# Altium project UmbilicalBoardV5.PrjPcb
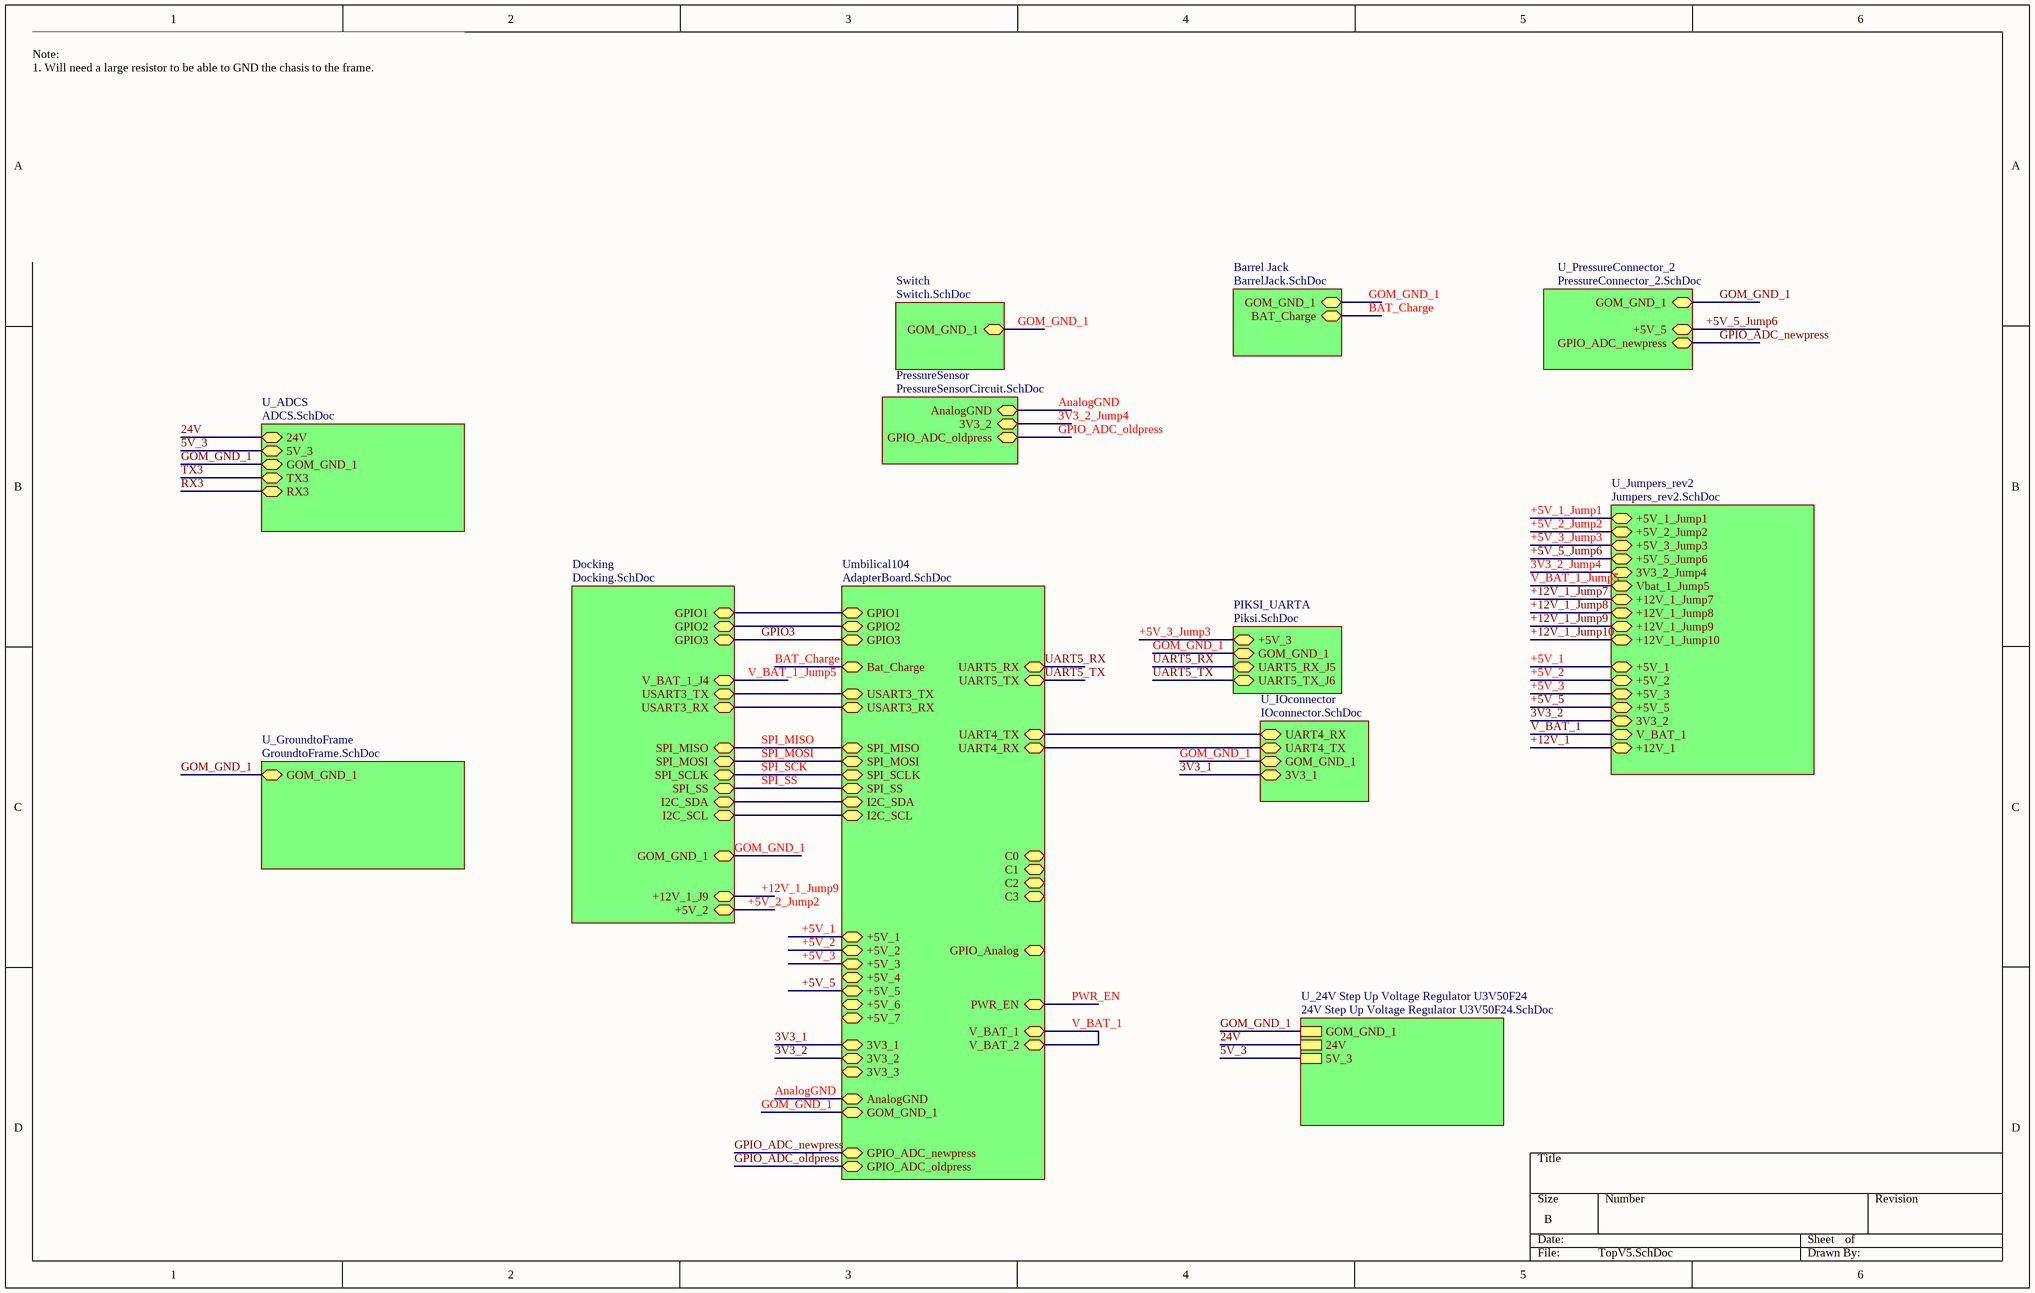
[diagram p0: TopV5.SchDoc]
13 sheets, 60 parts. Net scope: hierarchical (ports join the sheet entries above them; power ports are global).
Board files: 2016-05-17_12-43-15.PcbDoc, UmbilicalBoardV5.PcbDoc
Sheets:
  TopV5.SchDoc
    Umbilical104 = AdapterBoard.SchDoc
    Switch = Switch.SchDoc
    Docking = Docking.SchDoc
    PIKSI_UARTA = Piksi.SchDoc
    PressureSensor = PressureSensorCircuit.SchDoc
    Barrel Jack = BarrelJack.SchDoc
    U_IOconnector = IOconnector.SchDoc
    U_Jumpers_rev2 = Jumpers_rev2.SchDoc
    U_PressureConnector_2 = PressureConnector_2.SchDoc
    U_ADCS = ADCS.SchDoc
    U_24V Step Up Voltage Regulator U3V50F24 = 24V Step Up Voltage Regulator U3V50F24.SchDoc
    U_GroundtoFrame = GroundtoFrame.SchDoc

## Sheet TopV5.SchDoc
size B; Organization: Cornell University; DocumentNumber: 1 of 11; SheetNumber: 1; SheetTotal: 11; DocumentName: Top Sheet; ProjectName: OAAN

### Sub-sheets
Barrel Jack = BarrelJack.SchDoc: GOM_GND_1 (bidir), BAT_Charge (bidir)
Docking = Docking.SchDoc: V_BAT_1_J4 (bidir), USART3_TX (bidir), SPI_SS (bidir), I2C_SDA (bidir), I2C_SCL (bidir), SPI_MOSI (bidir), SPI_SCLK (bidir), GPIO3 (bidir), +5V_2 (bidir), USART3_RX (bidir), SPI_MISO (bidir), GPIO2 (bidir), +12V_1_J9 (bidir), GPIO1 (bidir), GOM_GND_1 (bidir)
PIKSI_UARTA = Piksi.SchDoc: UART5_RX_J5 (bidir), UART5_TX_J6 (bidir), GOM_GND_1 (bidir), +5V_3 (bidir)
PressureSensor = PressureSensorCircuit.SchDoc: GPIO_ADC_oldpress (bidir), 3V3_2 (bidir), AnalogGND (bidir)
Switch = Switch.SchDoc: GOM_GND_1 (bidir)
U_24V Step Up Voltage Regulator U3V50F24 = 24V Step Up Voltage Regulator U3V50F24.SchDoc: GOM_GND_1, 24V, 5V_3
U_ADCS = ADCS.SchDoc: 24V (bidir), 5V_3 (bidir), GOM_GND_1 (bidir), TX3 (bidir), RX3 (bidir)
U_GroundtoFrame = GroundtoFrame.SchDoc: GOM_GND_1 (bidir)
U_IOconnector = IOconnector.SchDoc: UART4_RX (bidir), UART4_TX (bidir), GOM_GND_1 (bidir), 3V3_1 (bidir)
U_Jumpers_rev2 = Jumpers_rev2.SchDoc: +5V_1_Jump1 (bidir), +5V_2_Jump2 (bidir), +5V_3_Jump3 (bidir), 3V3_2_Jump4 (bidir), Vbat_1_Jump5 (bidir), +5V_1 (bidir), +5V_2 (bidir), 3V3_2 (bidir), V_BAT_1 (bidir), +5V_3 (bidir), +5V_5_Jump6 (bidir), +5V_5 (bidir), +12V_1_Jump7 (bidir), +12V_1 (bidir), +12V_1_Jump9 (bidir), +12V_1_Jump8 (bidir), +12V_1_Jump10 (bidir)
U_PressureConnector_2 = PressureConnector_2.SchDoc: GOM_GND_1 (bidir), +5V_5 (bidir), GPIO_ADC_newpress (bidir)
Umbilical104 = AdapterBoard.SchDoc: C0 (bidir), 3V3_1 (bidir), USART3_TX (bidir), USART3_RX (bidir), GPIO3 (bidir), GPIO2 (bidir), GPIO1 (bidir), Bat_Charge (bidir), V_BAT_1 (bidir), I2C_SCL (bidir), SPI_MOSI (bidir), +5V_1 (bidir), I2C_SDA (bidir), SPI_MISO (bidir), SPI_SCLK (bidir), SPI_SS (bidir), UART5_RX (bidir), UART5_TX (bidir), UART4_TX (bidir), UART4_RX (bidir), C3 (bidir), C1 (bidir), C2 (bidir), +5V_3 (bidir), +5V_6 (bidir), +5V_5 (bidir), +5V_2 (bidir), 3V3_2 (bidir), +5V_4 (bidir), 3V3_3 (bidir), +5V_7 (bidir), GOM_GND_1 (bidir), AnalogGND (bidir), PWR_EN (bidir), V_BAT_2 (bidir), GPIO_ADC_newpress (bidir), GPIO_ADC_oldpress (bidir), GPIO_Analog (bidir)

### Nets
3V3_1: sheet Umbilical104/3V3_1, sheet U_IOconnector/3V3_1
3V3_2: sheet Umbilical104/3V3_2, sheet U_Jumpers_rev2/3V3_2
3V3_2_Jump4: sheet PressureSensor/3V3_2, sheet U_Jumpers_rev2/3V3_2_Jump4
5V_3: sheet U_ADCS/5V_3, sheet U_24V Step Up Voltage Regulator U3V50F24/5V_3
24V: sheet U_ADCS/24V, sheet U_24V Step Up Voltage Regulator U3V50F24/24V
+5V_1: sheet Umbilical104/+5V_1, sheet U_Jumpers_rev2/+5V_1
+5V_2: sheet Umbilical104/+5V_2, sheet U_Jumpers_rev2/+5V_2
+5V_2_Jump2: sheet Docking/+5V_2, sheet U_Jumpers_rev2/+5V_2_Jump2
+5V_3: sheet Umbilical104/+5V_3, sheet U_Jumpers_rev2/+5V_3
+5V_3_Jump3: sheet PIKSI_UARTA/+5V_3, sheet U_Jumpers_rev2/+5V_3_Jump3
+5V_5: sheet Umbilical104/+5V_5, sheet U_Jumpers_rev2/+5V_5
+5V_5_Jump6: sheet U_Jumpers_rev2/+5V_5_Jump6, sheet U_PressureConnector_2/+5V_5
+12V_1_Jump9: sheet Docking/+12V_1_J9, sheet U_Jumpers_rev2/+12V_1_Jump9
AnalogGND: sheet Umbilical104/AnalogGND, sheet PressureSensor/AnalogGND
BAT_Charge: sheet Umbilical104/Bat_Charge, sheet Barrel Jack/BAT_Charge
GOM_GND_1: sheet Umbilical104/GOM_GND_1, sheet Switch/GOM_GND_1, sheet Docking/GOM_GND_1, sheet PIKSI_UARTA/GOM_GND_1, sheet Barrel Jack/GOM_GND_1, sheet U_IOconnector/GOM_GND_1, sheet U_PressureConnector_2/GOM_GND_1, sheet U_ADCS/GOM_GND_1, sheet U_24V Step Up Voltage Regulator U3V50F24/GOM_GND_1, sheet U_GroundtoFrame/GOM_GND_1
GPIO3: sheet Umbilical104/GPIO3, sheet Docking/GPIO3
GPIO_ADC_newpress: sheet Umbilical104/GPIO_ADC_newpress, sheet U_PressureConnector_2/GPIO_ADC_newpress
GPIO_ADC_oldpress: sheet Umbilical104/GPIO_ADC_oldpress, sheet PressureSensor/GPIO_ADC_oldpress
PWR_EN: sheet Umbilical104/PWR_EN
SPI_MISO: sheet Umbilical104/SPI_MISO, sheet Docking/SPI_MISO
SPI_MOSI: sheet Umbilical104/SPI_MOSI, sheet Docking/SPI_MOSI
SPI_SCK: sheet Umbilical104/SPI_SCLK, sheet Docking/SPI_SCLK
SPI_SS: sheet Umbilical104/SPI_SS, sheet Docking/SPI_SS
UART5_RX: sheet Umbilical104/UART5_RX, sheet PIKSI_UARTA/UART5_RX_J5
UART5_TX: sheet Umbilical104/UART5_TX, sheet PIKSI_UARTA/UART5_TX_J6
V_BAT_1: sheet Umbilical104/V_BAT_1, sheet Umbilical104/V_BAT_2, sheet U_Jumpers_rev2/V_BAT_1
V_BAT_1_Jump5: sheet Docking/V_BAT_1_J4, sheet U_Jumpers_rev2/Vbat_1_Jump5
NetDocking_0: sheet Umbilical104/GPIO1, sheet Docking/GPIO1
NetDocking_1: sheet Umbilical104/GPIO2, sheet Docking/GPIO2
NetDocking_15: sheet Umbilical104/USART3_TX, sheet Docking/USART3_TX
NetDocking_16: sheet Umbilical104/USART3_RX, sheet Docking/USART3_RX
NetDocking_22: sheet Umbilical104/I2C_SDA, sheet Docking/I2C_SDA
NetDocking_23: sheet Umbilical104/I2C_SCL, sheet Docking/I2C_SCL
NetIOconn_rev2_1: sheet Umbilical104/UART4_TX, sheet U_IOconnector/UART4_RX
NetIOconn_rev2_2: sheet Umbilical104/UART4_RX, sheet U_IOconnector/UART4_TX

### Notes on the sheet
- Note:
  1. Will need a large resistor to be able to GND the chasis to the frame.

## Sheet AdapterBoard.SchDoc
size C
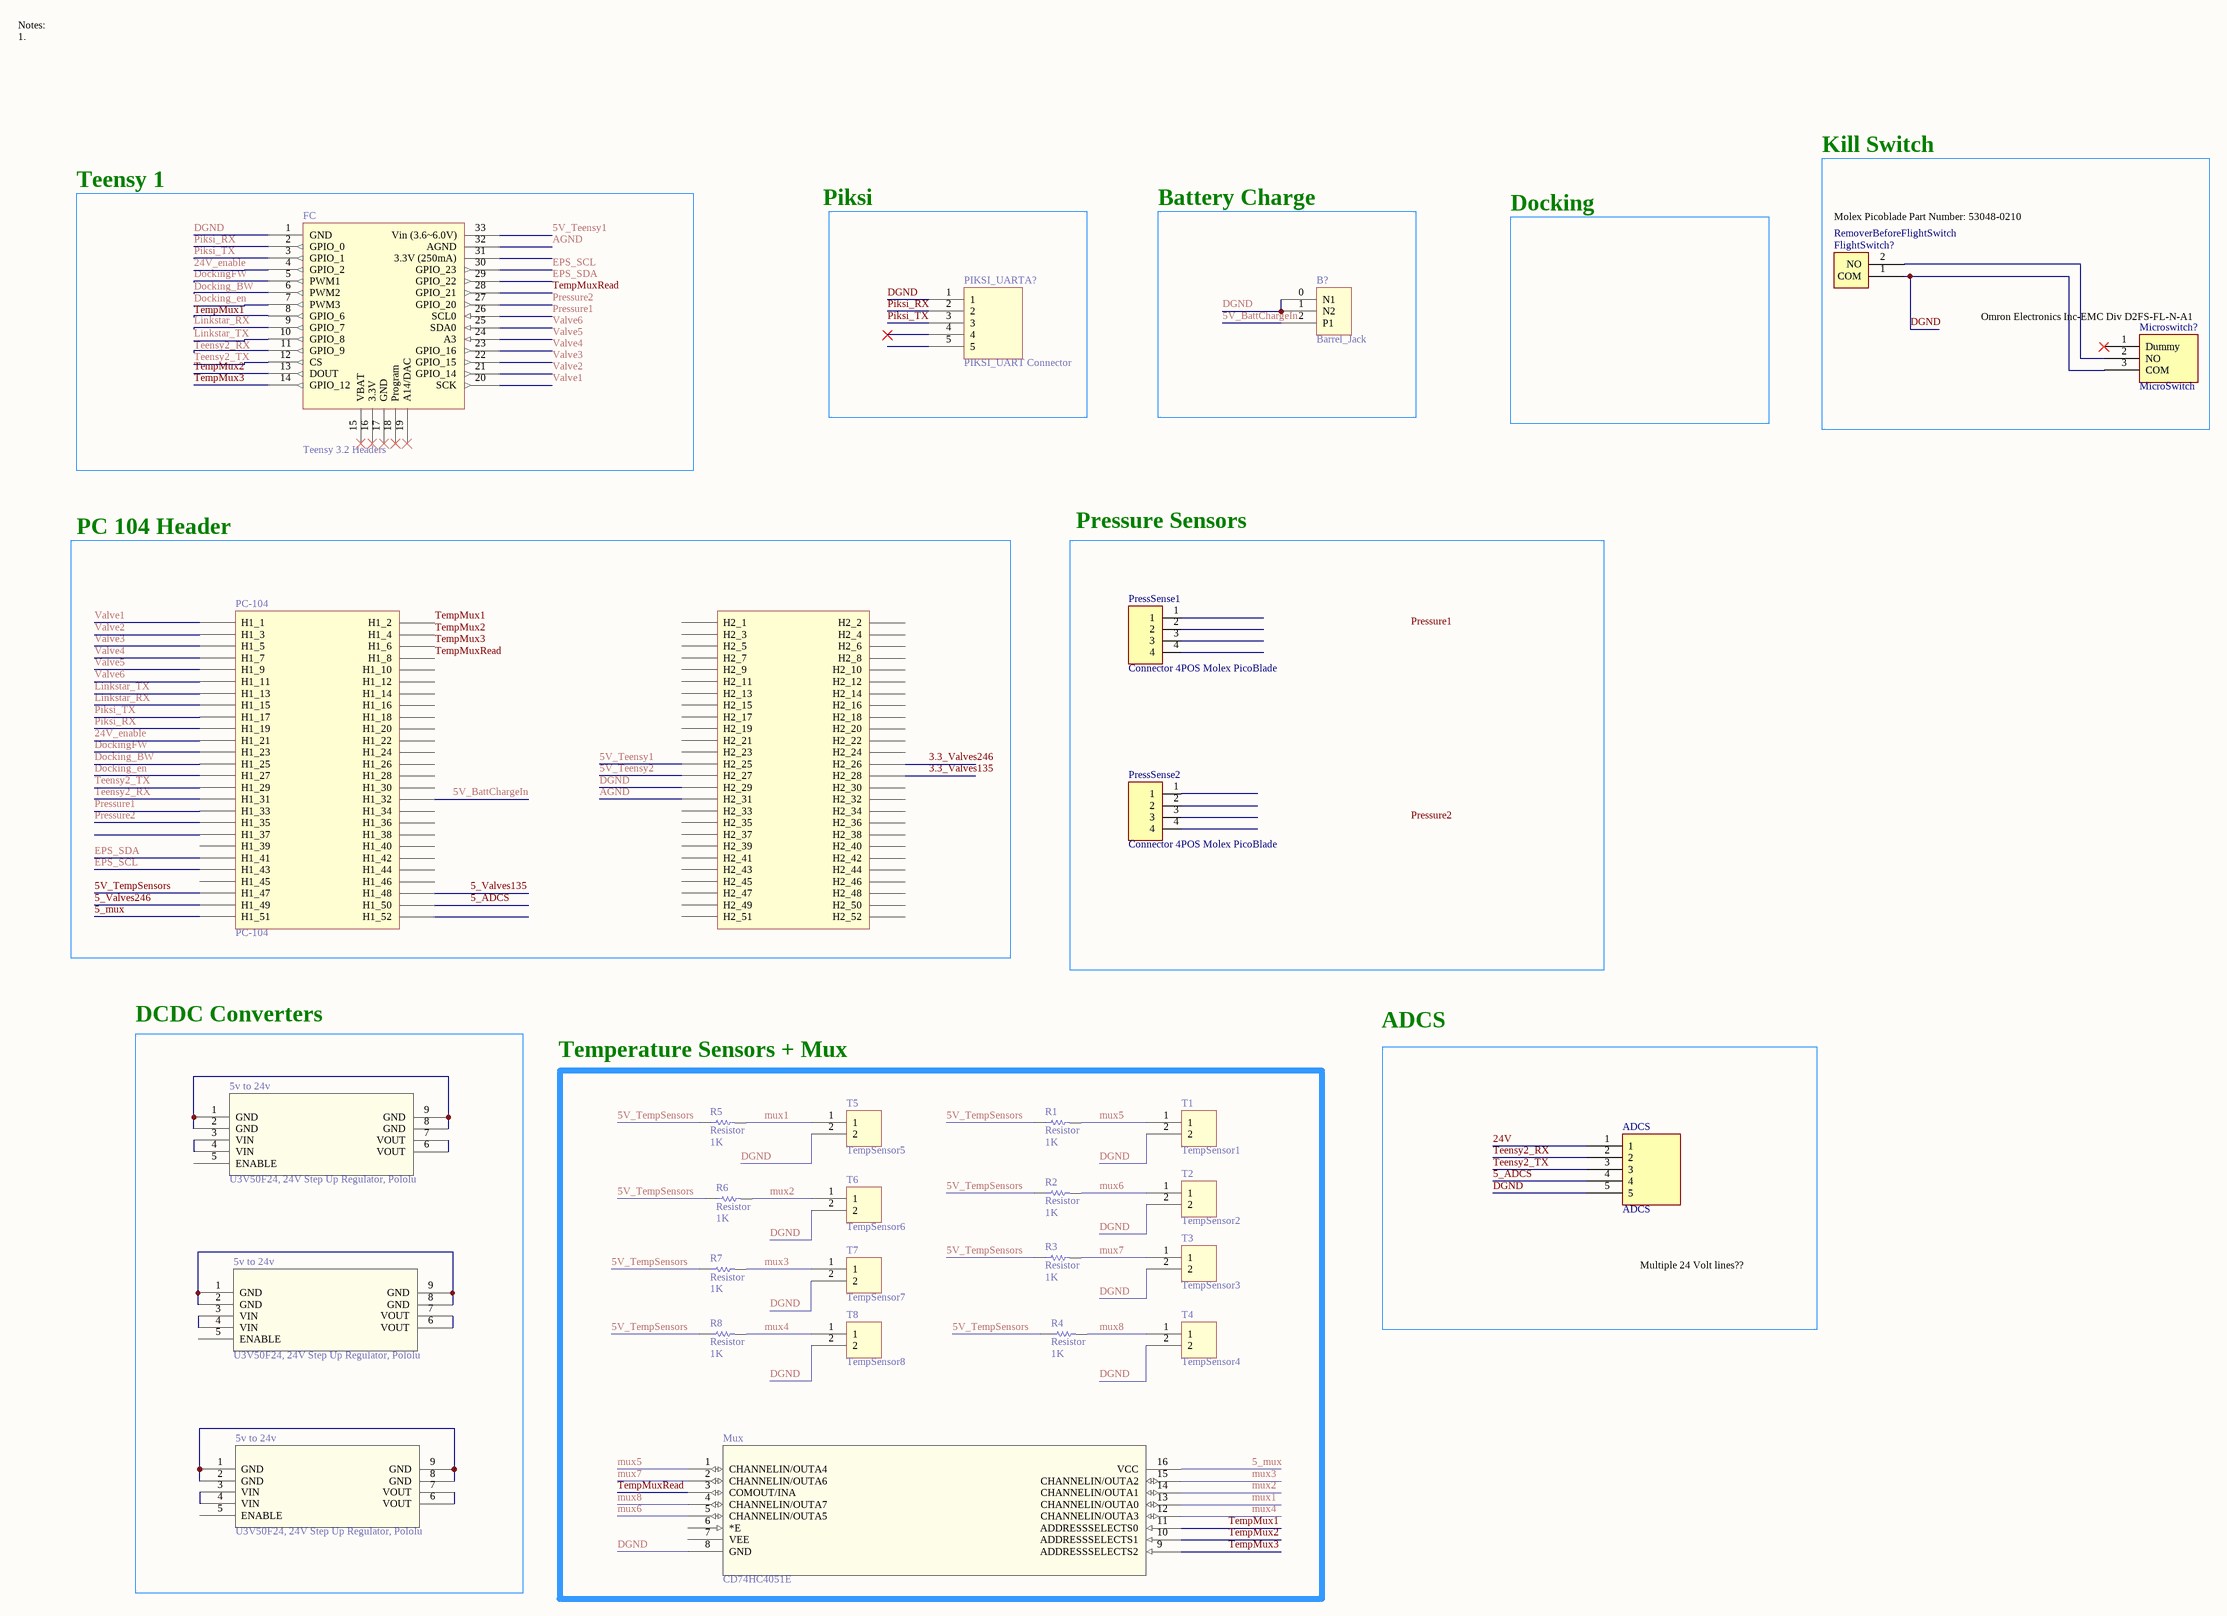
[diagram p1: AdapterBoard.SchDoc]

### Parts
(Parts that share a designator on the sheet are numbered #1, #2 ... from top to bottom, then left to right.)
5v_to_24v#1  U3V50F24, 24V Step Up Regulator, Pololu  [U3V50F24]
5v_to_24v#2  U3V50F24, 24V Step Up Regulator, Pololu  [U3V50F24]
5v_to_24v#3  U3V50F24, 24V Step Up Regulator, Pololu  [U3V50F24]
ADCS  ADCS  [Molex Picoblade 5 Pin]
B?  Barrel_Jack  [Barrel_Jack]
FC  Teensy 3.2 Headers  [Teensy 3.2 SMD Headers]
FlightSwitch?  RemoverBeforeFlightSwitch  [RemoverBeforeFlight Switch]
Microswitch?  MicroSwitch  [MicroSwitch_3pin]
Mux  CD74HC4051E  [N16]
PC-104  PC-104  [PC-104FOOTPRINT]
PIKSI_UARTA?  PIKSI_UART Connector  [Molex Picoblade 5 Pin]
PressSense1  Connector 4POS Molex PicoBlade  [532610471]
PressSense2  Connector 4POS Molex PicoBlade  [532610471]
R1  Resistor  value 1K  [AXIAL-0.3]
R2  Resistor  value 1K  [AXIAL-0.3]
R3  Resistor  value 1K  [AXIAL-0.3]
R4  Resistor  value 1K  [AXIAL-0.3]
R5  Resistor  value 1K  [AXIAL-0.3]
R6  Resistor  value 1K  [AXIAL-0.3]
R7  Resistor  value 1K  [AXIAL-0.3]
R8  Resistor  value 1K  [AXIAL-0.3]
T1  TempSensor1  [RemoverBeforeFlight Switch]
T2  TempSensor2  [RemoverBeforeFlight Switch]
T3  TempSensor3  [RemoverBeforeFlight Switch]
T4  TempSensor4  [RemoverBeforeFlight Switch]
T5  TempSensor5  [RemoverBeforeFlight Switch]
T6  TempSensor6  [RemoverBeforeFlight Switch]
T7  TempSensor7  [RemoverBeforeFlight Switch]
T8  TempSensor8  [RemoverBeforeFlight Switch]

### Blocks framed on the sheet
Kill Switch: FlightSwitch? Microswitch?
Teensy 1: FC
Battery Charge: B?
PC 104 Header: PC-104
Pressure Sensors: PressSense1 PressSense2
DCDC Converters: 5v_to_24v#1-5v_to_24v#3
ADCS: ADCS
Temperature Sensors + Mux: Mux R1-R8 T1-T8

### Nets
3.3_Valves135: PC-104.H2_28
3.3_Valves246: PC-104.H2_26
5_ADCS: ADCS.4 PC-104.H1_50
5_mux: Mux.16(VCC) PC-104.H1_51
5_Valves135: PC-104.H1_48
5_Valves246: PC-104.H1_49
5V_BattChargeIn: B?.2(P1) PC-104.H1_32
5V_Teensy1: FC.33(Vin_(3.6~6.0V)) PC-104.H2_25
5V_Teensy2: PC-104.H2_27
5V_TempSensors: PC-104.H1_47 R1.1 R2.1 R3.1 R4.1 R5.1 R6.1 R7.1 R8.1
24V: ADCS.1
24V_enable: FC.4(GPIO_2) PC-104.H1_21
AGND: FC.32(AGND) PC-104.H2_31
DGND: ADCS.5 B?.0(N1) B?.1(N2) FC.1(GND) FlightSwitch?.1(COM) Microswitch?.3(COM) Mux.8(GND) PC-104.H2_29 PIKSI_UARTA?.1 T1.2 T2.2 T3.2 T4.2 T5.2 T6.2 T7.2 T8.2
Docking_BW: FC.6(PWM2) PC-104.H1_25
Docking_en: FC.7(PWM3) PC-104.H1_27
DockingFW: FC.5(PWM1) PC-104.H1_23
EPS_SCL: FC.30(GPIO_23) PC-104.H1_43
EPS_SDA: FC.29(GPIO_22) PC-104.H1_41
Linkstar_RX: FC.9(GPIO_7) PC-104.H1_15
Linkstar_TX: FC.10(GPIO_8) PC-104.H1_13
mux1: Mux.13(CHANNELIN/OUTA0) R5.2 T5.1
mux2: Mux.14(CHANNELIN/OUTA1) R6.2 T6.1
mux3: Mux.15(CHANNELIN/OUTA2) R7.2 T7.1
mux4: Mux.12(CHANNELIN/OUTA3) R8.2 T8.1
mux5: Mux.1(CHANNELIN/OUTA4) R1.2 T1.1
mux6: Mux.5(CHANNELIN/OUTA5) R2.2 T2.1
mux7: Mux.2(CHANNELIN/OUTA6) R3.2 T3.1
mux8: Mux.4(CHANNELIN/OUTA7) R4.2 T4.1
Piksi_RX: FC.2(GPIO_0) PC-104.H1_19 PIKSI_UARTA?.2
Piksi_TX: FC.3(GPIO_1) PC-104.H1_17 PIKSI_UARTA?.3
Pressure1: FC.26(SCL0) PC-104.H1_33
Pressure2: FC.27(GPIO_20) PC-104.H1_35
Teensy2_RX: ADCS.2 FC.11(GPIO_9) PC-104.H1_31
Teensy2_TX: ADCS.3 FC.12(CS) PC-104.H1_29
TempMux1: FC.8(GPIO_6) Mux.11(ADDRESSSELECTS0) PC-104.H1_2
TempMux2: FC.13(DOUT) Mux.10(ADDRESSSELECTS1) PC-104.H1_4
TempMux3: FC.14(GPIO_12) Mux.9(ADDRESSSELECTS2) PC-104.H1_6
TempMuxRead: FC.28(GPIO_21) Mux.3(COMOUT/INA) PC-104.H1_8
Valve1: FC.20(SCK) PC-104.H1_1
Valve2: FC.21(GPIO_14) PC-104.H1_3
Valve3: FC.22(GPIO_15) PC-104.H1_5
Valve4: FC.23(GPIO_16) PC-104.H1_7
Valve5: FC.24(A3) PC-104.H1_9
Valve6: FC.25(SDA0) PC-104.H1_11
Net5v_to_24v#1_1: 5v_to_24v#1.1(GND) 5v_to_24v#1.2(GND) 5v_to_24v#1.8(GND) 5v_to_24v#1.9(GND)
Net5v_to_24v#1_3: 5v_to_24v#1.3(VIN) 5v_to_24v#1.4(VIN)
Net5v_to_24v#1_6: 5v_to_24v#1.6(VOUT) 5v_to_24v#1.7(VOUT)
Net5v_to_24v#2_1: 5v_to_24v#2.1(GND) 5v_to_24v#2.2(GND) 5v_to_24v#2.8(GND) 5v_to_24v#2.9(GND)
Net5v_to_24v#2_3: 5v_to_24v#2.3(VIN) 5v_to_24v#2.4(VIN)
Net5v_to_24v#3_1: 5v_to_24v#3.1(GND) 5v_to_24v#3.2(GND) 5v_to_24v#3.8(GND) 5v_to_24v#3.9(GND)
Net5v_to_24v#3_3: 5v_to_24v#3.3(VIN) 5v_to_24v#3.4(VIN)
Net5v_to_24v#3_6: 5v_to_24v#3.6(VOUT) 5v_to_24v#3.7(VOUT)
NetFlightSwitch?_2: FlightSwitch?.2(NO) Microswitch?.2(NO)

Not connected (* = marked no-connect by the designer): 5v_to_24v#1 5(ENABLE); 5v_to_24v#2 5(ENABLE) 6(VOUT) 7(VOUT); 5v_to_24v#3 5(ENABLE); FC 15(VBAT)* 16(3.3V)* 17(GND)* 18(Program)* 19(A14/DAC)* 31(3.3V_(250mA)); Microswitch? 1(Dummy)*; Mux 6(*E) 7(VEE); PC-104 H1_10 H1_12 H1_14 H1_16 H1_18 H1_20 H1_22 H1_24 H1_26 H1_28 H1_30 H1_34 H1_36 H1_37 H1_38 H1_39 H1_40 H1_42 H1_44 H1_45 H1_46 H1_52 H2_1 H2_2 H2_3 H2_4 H2_5 H2_6 H2_7 H2_8 H2_9 H2_10 H2_11 H2_12 H2_13 H2_14 H2_15 H2_16 H2_17 H2_18 H2_19 H2_20 H2_21 H2_22 H2_23 H2_24 H2_30 H2_32 H2_33 H2_34 H2_35 H2_36 H2_37 H2_38 H2_39 H2_40 H2_41 H2_42 H2_43 H2_44 H2_45 H2_46 H2_47 H2_48 H2_49 H2_50 H2_51 H2_52; PIKSI_UARTA? 4* 5; PressSense1 1 2 3 4; PressSense2 1 2 3 4

### Notes on the sheet
- Notes:
  1.
- Piksi
- Docking
- (near FlightSwitch?) Molex Picoblade Part Number: 53048-0210
- (near Microswitch?) Omron Electronics Inc-EMC Div D2FS-FL-N-A1
- Multiple 24 Volt lines??
- Labels drawn without touching a wire or pin: Pressure1, Pressure2

### Library data of the parts
5v_to_24v#1-5v_to_24v#3 = U3V50F24, 24V Step Up Regulator, Pololu: 4V Step Up Regulator
ADCS PIKSI_UARTA? = PIKSI_UART Connector: Molex Picoblade 53261-0571
FlightSwitch? T1-T8 = RemoverBeforeFlightSwitch: 53048-0210 Molex Picoblade
Microswitch? = MicroSwitch: Omron Electronics Inc-EMC Div D2FS-FL-N-A1
Mux = CD74HC4051E: Imported; Vendor: Texas Instruments; Section: Unknown; C: Copyright (C) 2015 Accelerated Designs. All rights reserved; Manufacturer_Part_Number: CD74HC4051E; Family: Unknown; Manufacturer_Name: Texas Instruments; Copyright: Copyright (C) 2015 Accelerated Designs. All rights reserved; RS_Part_Number: 526694; Value: Value; Type: Type; RefDes: RefDes
PC-104 = PC-104: ESQ-126-14-G-D (2 total needed)
PressSense1 PressSense2 = 532610471
R1-R8 = Res1: Published: 8-Jun-2000; LatestRevisionDate: 17-Jul-2002; LatestRevisionNote: Re-released for DXP Platform.; PackageReference: AXIAL-0.3; Publisher: Altium Limited; PackageDescription: Axial Device, Thru-Hole; 2 Leads; 0.3 in Pin Spacing

## Sheet Switch.SchDoc
size B
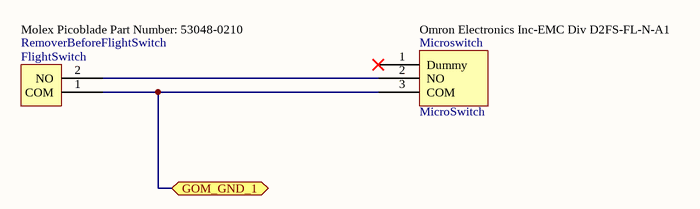
[diagram p2: Switch.SchDoc]

### Parts
FlightSwitch  RemoverBeforeFlightSwitch  [RemoverBeforeFlight Switch]
Microswitch  MicroSwitch  [MicroSwitch_3pin]

### Ports
GOM_GND_1 (bidir)

### Nets
GOM_GND_1: FlightSwitch.1(COM) Microswitch.3(COM) ; port GOM_GND_1
NetFlightSwitch_2: FlightSwitch.2(NO) Microswitch.2(NO)

Not connected (* = marked no-connect by the designer): Microswitch 1(Dummy)*

### Notes on the sheet
- (near FlightSwitch) Molex Picoblade Part Number: 53048-0210
- (near Microswitch) Omron Electronics Inc-EMC Div D2FS-FL-N-A1

### Library data of the parts
FlightSwitch = RemoverBeforeFlightSwitch: 53048-0210 Molex Picoblade
Microswitch = MicroSwitch: as Microswitch? on sheet AdapterBoard

## Sheet Docking.SchDoc
size B
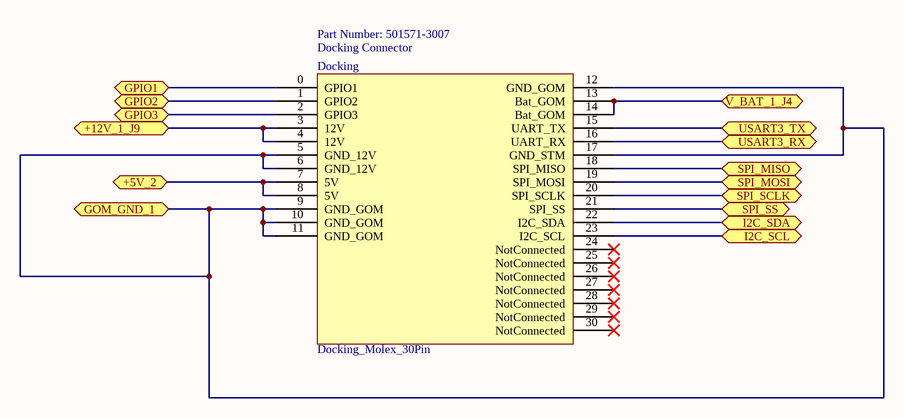
[diagram p3: Docking.SchDoc]

### Parts
Docking  Docking_Molex_30Pin  [Docking_Molex_30Pin]

### Ports
+5V_2 (bidir), +12V_1_J9 (bidir), GOM_GND_1 (bidir), GPIO1 (bidir), GPIO2 (bidir), GPIO3 (bidir), I2C_SCL (bidir), I2C_SDA (bidir), SPI_MISO (bidir), SPI_MOSI (bidir), SPI_SCLK (bidir), SPI_SS (bidir), USART3_RX (bidir), USART3_TX (bidir), V_BAT_1_J4 (bidir)

### Nets
+5V_2_Jump2: Docking.7(5V) Docking.8(5V) ; port +5V_2
+12V_1_Jump9: Docking.3(12V) Docking.4(12V) ; port +12V_1_J9
GOM_GND_1: Docking.5(GND_12V) Docking.6(GND_12V) Docking.9(GND_GOM) Docking.10(GND_GOM) Docking.11(GND_GOM) Docking.12(GND_GOM) Docking.17(GND_STM) ; port GOM_GND_1
GPIO3: Docking.2(GPIO3) ; port GPIO3
SPI_MISO: Docking.18(SPI_MISO) ; port SPI_MISO
SPI_MOSI: Docking.19(SPI_MOSI) ; port SPI_MOSI
SPI_SCK: Docking.20(SPI_SCLK) ; port SPI_SCLK
SPI_SS: Docking.21(SPI_SS) ; port SPI_SS
V_BAT_1_Jump5: Docking.13(Bat_GOM) Docking.14(Bat_GOM) ; port V_BAT_1_J4
NetDocking_0: Docking.0(GPIO1) ; port GPIO1
NetDocking_1: Docking.1(GPIO2) ; port GPIO2
NetDocking_15: Docking.15(UART_TX) ; port USART3_TX
NetDocking_16: Docking.16(UART_RX) ; port USART3_RX
NetDocking_22: Docking.22(I2C_SDA) ; port I2C_SDA
NetDocking_23: Docking.23(I2C_SCL) ; port I2C_SCL

Not connected (* = marked no-connect by the designer): Docking 24(NotConnected)* 25(NotConnected)* 26(NotConnected)* 27(NotConnected)* 28(NotConnected)* 29(NotConnected)* 30(NotConnected)*

### Notes on the sheet
- (near Docking) Part Number: 501571-3007
- (near Docking) Docking Connector

### Library data of the parts
Docking = Docking_Molex_30Pin: 24 Pin Connector; pin to pad: 0>A1 1>A2 2>A3 3>A4 4>A5 5>A6 6>A7 7>A8 8>A9 9>A10 10>A11 11>A12 12>A13 13>A14 14>A15 15>A16 16>A17 17>A18 18>A19 19>A20 20>A21 21>A22 22>A23 23>A24 24>A25

## Sheet Piksi.SchDoc
size B
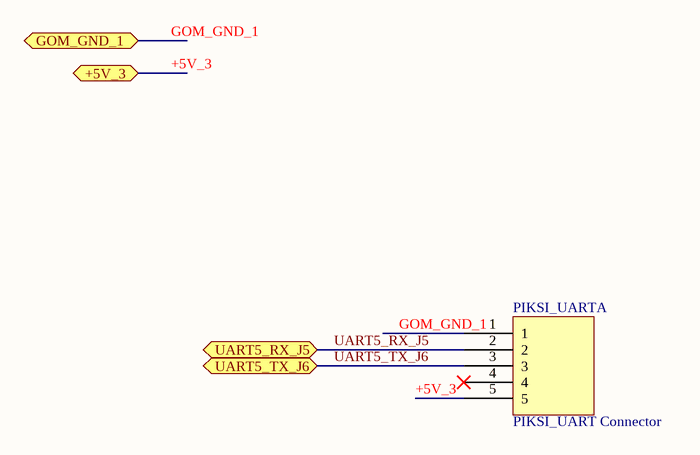
[diagram p4: Piksi.SchDoc]

### Parts
PIKSI_UARTA  PIKSI_UART Connector  [Molex Picoblade 5 Pin]

### Ports
+5V_3 (bidir), GOM_GND_1 (bidir), UART5_RX_J5 (bidir), UART5_TX_J6 (bidir)

### Nets
+5V_3: PIKSI_UARTA.5 ; port +5V_3  [project net +5V_3_Jump3]
GOM_GND_1: PIKSI_UARTA.1 ; port GOM_GND_1
UART5_RX_J5: PIKSI_UARTA.2 ; port UART5_RX_J5  [project net UART5_RX]
UART5_TX_J6: PIKSI_UARTA.3 ; port UART5_TX_J6  [project net UART5_TX]

Not connected (* = marked no-connect by the designer): PIKSI_UARTA 4*

### Library data of the parts
PIKSI_UARTA = PIKSI_UART Connector: Molex Picoblade 53261-0571

## Sheet PressureSensorCircuit.SchDoc
size A
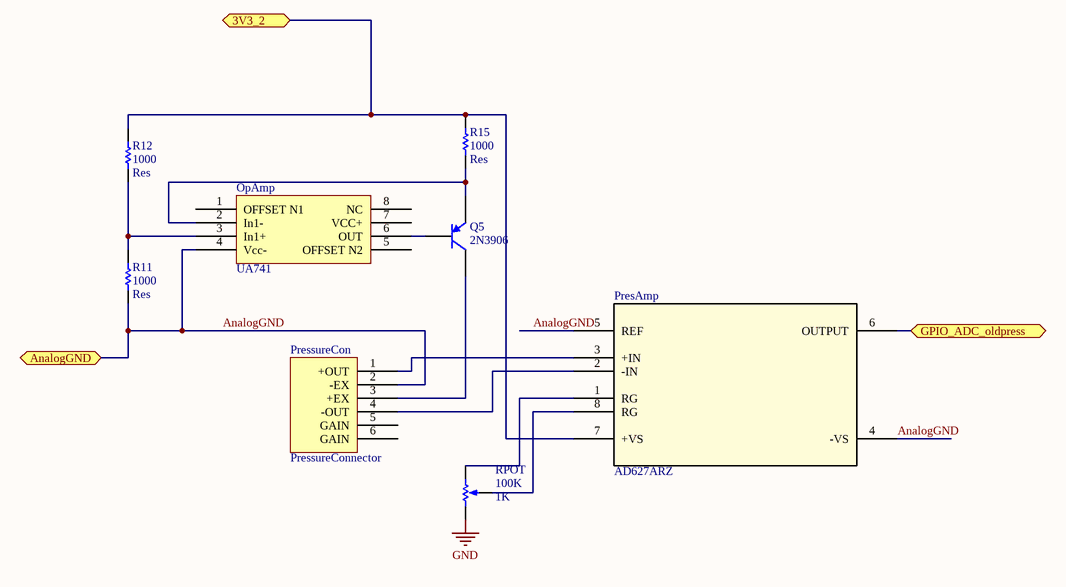
[diagram p5: PressureSensorCircuit.SchDoc]

### Parts
OpAmp  UA741  [UA741]
PresAmp  AD627ARZ  [R_8]
PressureCon  PressureConnector  [Pressure Connector]
Q5  2N3906  [TO-92A]
R11  1000  value Res  [AXIAL-0.3]
R12  1000  value Res  [AXIAL-0.3]
R15  1000  value Res  [AXIAL-0.3]
RPOT  100K  value 1K  [VR5]

### Ports
3V3_2 (bidir), AnalogGND (bidir), GPIO_ADC_oldpress (bidir)

### Nets
GND: RPOT.1(TOP)
3V3_2_Jump4: PresAmp.7(+VS) R12.1 R15.1 ; port 3V3_2
AnalogGND: OpAmp.4(Vcc-) PresAmp.4(-VS) PresAmp.5(REF) PressureCon.2(-EX) R11.2 ; port AnalogGND
GPIO_ADC_oldpress: PresAmp.6(OUTPUT) ; port GPIO_ADC_oldpress
NetOpAmp_2: OpAmp.2(In1-) Q5.1(E) R15.2
NetOpAmp_3: OpAmp.3(In1+) R11.1 R12.2
NetOpAmp_6: OpAmp.6(OUT) Q5.2(B)
NetPresAmp_1: PresAmp.1(RG) RPOT.2(BOT)
NetPresAmp_2: PresAmp.2(-IN) PressureCon.4(-OUT)
NetPresAmp_3: PresAmp.3(+IN) PressureCon.1(+OUT)
NetPresAmp_8: PresAmp.8(RG) RPOT.3(TAP)
NetPressureCon_3: PressureCon.3(+EX) Q5.3(C)

Not connected (* = marked no-connect by the designer): OpAmp 1(OFFSET_N1) 5(OFFSET_N2) 7(VCC+) 8(NC); PressureCon 5(GAIN) 6(GAIN)

### Library data of the parts
PresAmp = AD627ARZ: Imported; Manufacturer_Part_Number: AD627ARZ; Vendor: Vendor; RefDes: Refdes; Type: Type; Value: Value
PressureCon = PressureConnector: Molex 53261-0671
Q5 = 2N3906: PNP General Purpose Amplifier; Published: 8-Jun-2000; LatestRevisionDate: 15-Jan-2003; LatestRevisionNote: PCB Footprint 'BCY-W3/D4.7' replaced; DatasheetVersion: 1997; PackageVersion: Sep-1998; PackageReference: TO-92A; Publisher: Altium Limited; PackageDescription: TO, Flat Index; 3 In-Line, Axial Leads; Body Dia. 4.5mm; Leads 0.51 x 0.48 mm (max); ComponentLink1Description: Manufacturer Link; ComponentLink1URL: http://www.fairchildsemi.com/; ComponentLink2Description: Datasheet; ComponentLink2URL: http://www.fairchildsemi.com/ds/2N%2F2N3906.pdf
R11 R12 R15 = Res1: Resistor- 696-1552-ND; Published: 8-Jun-2000; LatestRevisionDate: 17-Jul-2002; LatestRevisionNote: Re-released for DXP Platform.; PackageReference: AXIAL-0.3; Publisher: Altium Limited; PackageDescription: Axial Device, Thru-Hole; 2 Leads; 0.3 in Pin Spacing
RPOT = RPot: Potentiometer; Sim Note: Enter the Resistance value and the set point into parameter fields.; Set Position: 0.5; Published: 8-Jun-2000; LatestRevisionDate: 17-Jul-2002; LatestRevisionNote: Re-released for DXP Platform.; PackageReference: VR5; Publisher: Altium Limited; PackageDescription: Variable Resistor, Thru-Hole; 3 Leads

## Sheet BarrelJack.SchDoc
size B
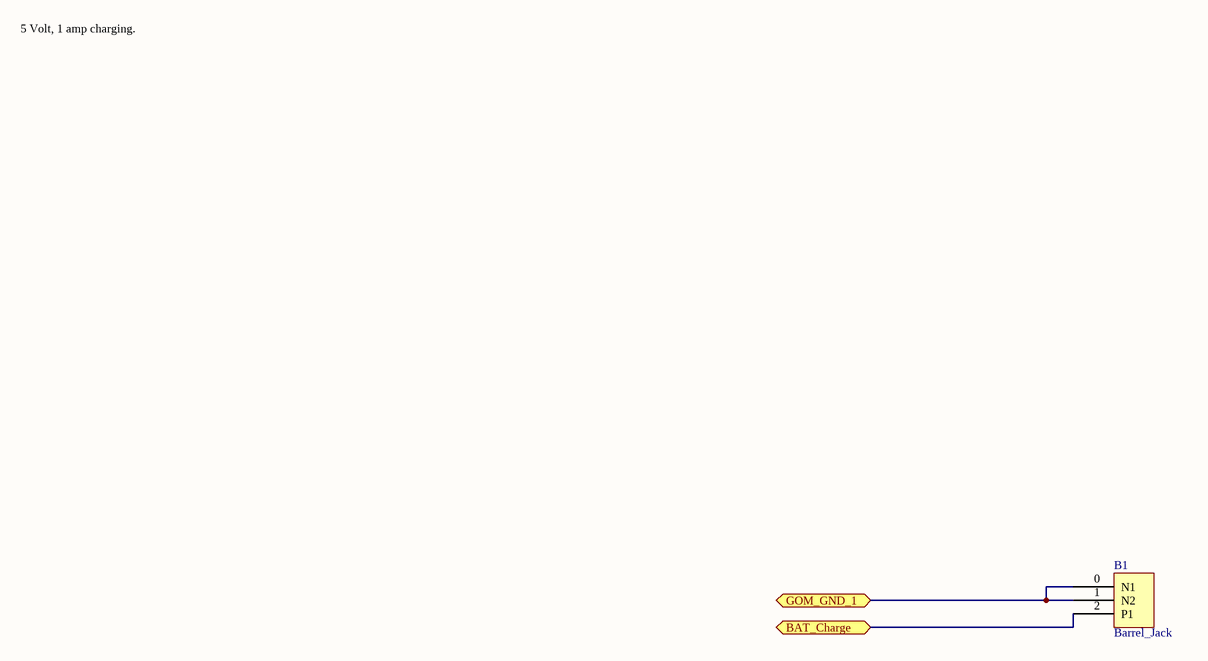
[diagram p6: BarrelJack.SchDoc]

### Parts
B1  Barrel_Jack  [Barrel_Jack]

### Ports
BAT_Charge (bidir), GOM_GND_1 (bidir)

### Nets
BAT_Charge: B1.2(P1) ; port BAT_Charge
GOM_GND_1: B1.0(N1) B1.1(N2) ; port GOM_GND_1

### Notes on the sheet
- 5 Volt, 1 amp charging.

## Sheet IOconnector.SchDoc
size B
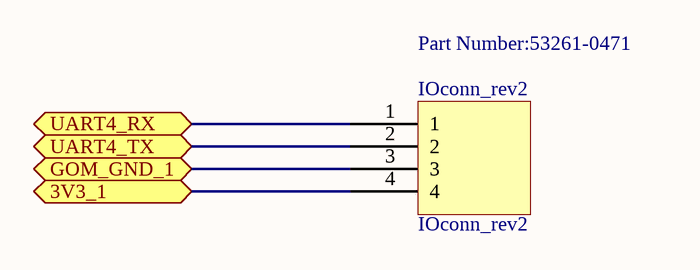
[diagram p7: IOconnector.SchDoc]

### Parts
IOconn_rev2  IOconn_rev2  [IOConn_Rev2]

### Ports
3V3_1 (bidir), GOM_GND_1 (bidir), UART4_RX (bidir), UART4_TX (bidir)

### Nets
3V3_1: IOconn_rev2.4 ; port 3V3_1
GOM_GND_1: IOconn_rev2.3 ; port GOM_GND_1
NetIOconn_rev2_1: IOconn_rev2.1 ; port UART4_RX
NetIOconn_rev2_2: IOconn_rev2.2 ; port UART4_TX

### Notes on the sheet
- (near IOconn_rev2) Part Number:53261-0471

### Library data of the parts
IOconn_rev2 = IOconn_rev2: Part Number: 53261-0471

## Sheet Jumpers_rev2.SchDoc
size B
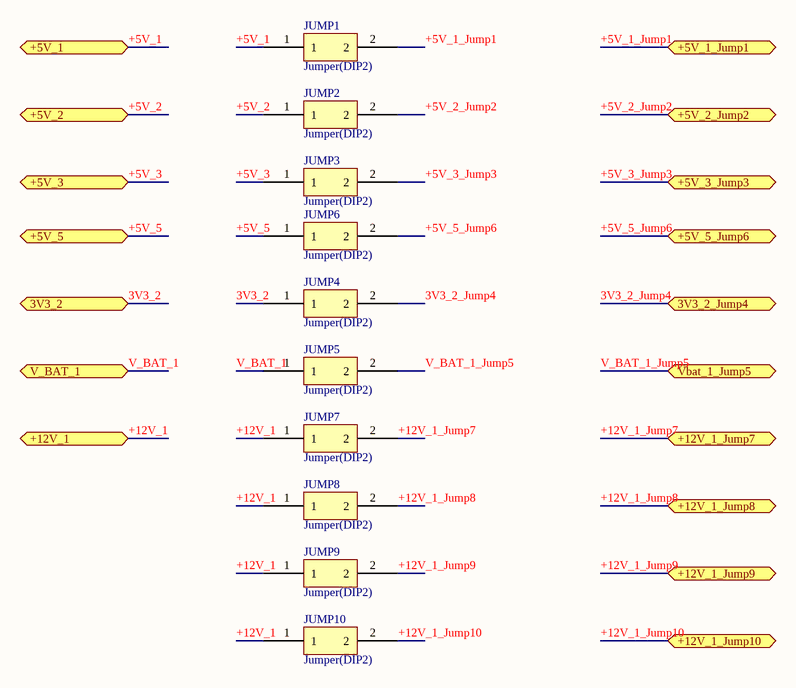
[diagram p8: Jumpers_rev2.SchDoc]

### Parts
JUMP1  Jumper(DIP2)  [Jumper(DIP2)]
JUMP2  Jumper(DIP2)  [Jumper(DIP2)]
JUMP3  Jumper(DIP2)  [Jumper(DIP2)]
JUMP4  Jumper(DIP2)  [Jumper(DIP2)]
JUMP5  Jumper(DIP2)  [Jumper(DIP2)]
JUMP6  Jumper(DIP2)  [Jumper(DIP2)]
JUMP7  Jumper(DIP2)  [Jumper(DIP2)]
JUMP8  Jumper(DIP2)  [Jumper(DIP2)]
JUMP9  Jumper(DIP2)  [Jumper(DIP2)]
JUMP10  Jumper(DIP2)  [Jumper(DIP2)]

### Ports
3V3_2 (bidir), 3V3_2_Jump4 (bidir), +5V_1 (bidir), +5V_1_Jump1 (bidir), +5V_2 (bidir), +5V_2_Jump2 (bidir), +5V_3 (bidir), +5V_3_Jump3 (bidir), +5V_5 (bidir), +5V_5_Jump6 (bidir), +12V_1 (bidir), +12V_1_Jump7 (bidir), +12V_1_Jump8 (bidir), +12V_1_Jump9 (bidir), +12V_1_Jump10 (bidir), V_BAT_1 (bidir), Vbat_1_Jump5 (bidir)

### Nets
3V3_2: JUMP4.1 ; port 3V3_2
3V3_2_Jump4: JUMP4.2 ; port 3V3_2_Jump4
+5V_1: JUMP1.1 ; port +5V_1
+5V_1_Jump1: JUMP1.2 ; port +5V_1_Jump1
+5V_2: JUMP2.1 ; port +5V_2
+5V_2_Jump2: JUMP2.2 ; port +5V_2_Jump2
+5V_3: JUMP3.1 ; port +5V_3
+5V_3_Jump3: JUMP3.2 ; port +5V_3_Jump3
+5V_5: JUMP6.1 ; port +5V_5
+5V_5_Jump6: JUMP6.2 ; port +5V_5_Jump6
+12V_1: JUMP7.1 JUMP8.1 JUMP9.1 JUMP10.1 ; port +12V_1
+12V_1_Jump7: JUMP7.2 ; port +12V_1_Jump7
+12V_1_Jump8: JUMP8.2 ; port +12V_1_Jump8
+12V_1_Jump9: JUMP9.2 ; port +12V_1_Jump9
+12V_1_Jump10: JUMP10.2 ; port +12V_1_Jump10
V_BAT_1: JUMP5.1 ; port V_BAT_1
V_BAT_1_Jump5: JUMP5.2 ; port Vbat_1_Jump5

## Sheet PressureConnector_2.SchDoc
size B
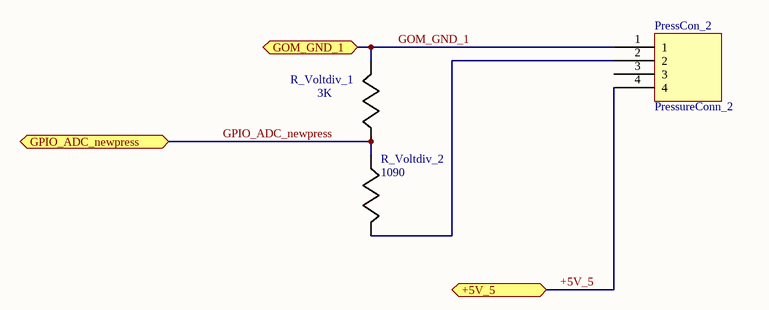
[diagram p9: PressureConnector_2.SchDoc]

### Parts
PressCon_2  PressureConn_2  [PressCon_2]
R_Voltdiv_1  3K  [0402]
R_Voltdiv_2  1090  [0402]

### Ports
+5V_5 (bidir), GOM_GND_1 (bidir), GPIO_ADC_newpress (bidir)

### Nets
+5V_5: PressCon_2.4 ; port +5V_5  [project net +5V_5_Jump6]
GOM_GND_1: PressCon_2.1 R_Voltdiv_1.1 ; port GOM_GND_1
GPIO_ADC_newpress: R_Voltdiv_1.2 R_Voltdiv_2.2 ; port GPIO_ADC_newpress
NetPressCon_2_2: PressCon_2.2 R_Voltdiv_2.1

Not connected (* = marked no-connect by the designer): PressCon_2 3

### Library data of the parts
R_Voltdiv_1 = CRCW040210R0FKED: Imported; Vendor: Vishay-Dale; Value: 3000; Manufacturer_Part_Number: CRCW040210R0FKED; Manufacturer_Name: Vishay-Dale; RefDes: RefDes; TYPE: TYPE
R_Voltdiv_2 = CRCW040210R0FKED: Imported; Vendor: Vishay-Dale; Manufacturer_Part_Number: CRCW040210R0FKED; Manufacturer_Name: Vishay-Dale; RefDes: RefDes; TYPE: TYPE; Value: 1090

## Sheet ADCS.SchDoc
size A
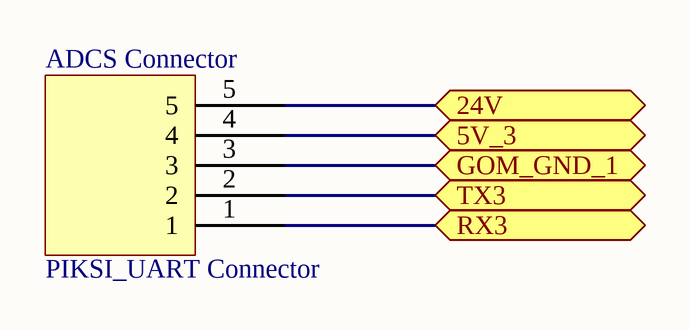
[diagram p10: ADCS.SchDoc]

### Parts
ADCS_Connector  PIKSI_UART Connector  [Molex Picoblade 5 Pin]

### Ports
5V_3 (bidir), 24V (bidir), GOM_GND_1 (bidir), RX3 (bidir), TX3 (bidir)

### Nets
5V_3: ADCS_Connector.4 ; port 5V_3
24V: ADCS_Connector.5 ; port 24V
GOM_GND_1: ADCS_Connector.3 ; port GOM_GND_1
RX3: ADCS_Connector.1 ; port RX3
TX3: ADCS_Connector.2 ; port TX3

### Library data of the parts
ADCS_Connector = PIKSI_UART Connector: Molex Picoblade 53261-0571

## Sheet 24V Step Up Voltage Regulator U3V50F24.SchDoc
size A
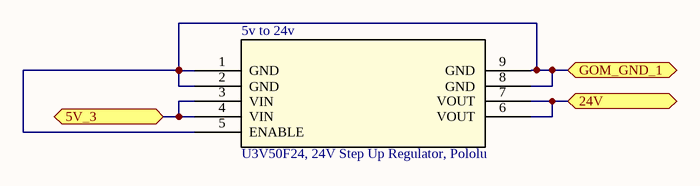
[diagram p11: 24V Step Up Voltage Regulator U3V50F24.SchDoc]

### Parts
(Parts that share a designator on the sheet are numbered #1, #2 ... from top to bottom, then left to right.)
5v_to_24v#4  U3V50F24, 24V Step Up Regulator, Pololu  [U3V50F24]

### Ports
5V_3, 24V, GOM_GND_1

### Nets
5V_3: 5v_to_24v#4.3(VIN) 5v_to_24v#4.4(VIN) ; port 5V_3
24V: 5v_to_24v#4.6(VOUT) 5v_to_24v#4.7(VOUT) ; port 24V
GOM_GND_1: 5v_to_24v#4.1(GND) 5v_to_24v#4.2(GND) 5v_to_24v#4.5(ENABLE) 5v_to_24v#4.8(GND) 5v_to_24v#4.9(GND) ; port GOM_GND_1

### Library data of the parts
5v_to_24v#4 = U3V50F24, 24V Step Up Regulator, Pololu: 4V Step Up Regulator

## Sheet GroundtoFrame.SchDoc
size B
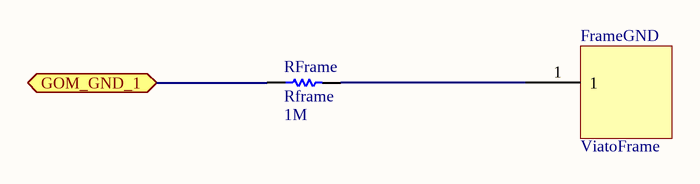
[diagram p12: GroundtoFrame.SchDoc]

### Parts
FrameGND  ViatoFrame  [ViatoFrame]
RFrame  Rframe  value 1M  [AXIAL-0.3]

### Ports
GOM_GND_1 (bidir)

### Nets
GOM_GND_1: RFrame.1 ; port GOM_GND_1
NetFrameGND_1: FrameGND.1 RFrame.2

### Library data of the parts
RFrame = Res1: Resistor -  CF14JT1M00CT-ND; Published: 8-Jun-2000; LatestRevisionDate: 17-Jul-2002; LatestRevisionNote: Re-released for DXP Platform.; PackageReference: AXIAL-0.3; Publisher: Altium Limited; PackageDescription: Axial Device, Thru-Hole; 2 Leads; 0.3 in Pin Spacing

## Nets that join several sheets
3V3_2_Jump4: PressureSensorCircuit (PresAmp.7 R12.1 R15.1), Jumpers_rev2 (JUMP4.2)
5V_3: ADCS (ADCS_Connector.4), 24V Step Up Voltage Regulator U3V50F24 (5v_to_24v#4.3 5v_to_24v#4.4)
24V: ADCS (ADCS_Connector.5), 24V Step Up Voltage Regulator U3V50F24 (5v_to_24v#4.6 5v_to_24v#4.7)
+5V_2_Jump2: Docking (Docking.7 Docking.8), Jumpers_rev2 (JUMP2.2)
+5V_3_Jump3: Piksi (PIKSI_UARTA.5), Jumpers_rev2 (JUMP3.2)
+5V_5_Jump6: Jumpers_rev2 (JUMP6.2), PressureConnector_2 (PressCon_2.4)
+12V_1_Jump9: Docking (Docking.3 Docking.4), Jumpers_rev2 (JUMP9.2)
GOM_GND_1: Switch (FlightSwitch.1 Microswitch.3), Docking (7 pins), Piksi (PIKSI_UARTA.1), BarrelJack (B1.0 B1.1), IOconnector (IOconn_rev2.3), PressureConnector_2 (PressCon_2.1 R_Voltdiv_1.1), ADCS (ADCS_Connector.3), 24V Step Up Voltage Regulator U3V50F24 (5 pins), GroundtoFrame (RFrame.1)
V_BAT_1_Jump5: Docking (Docking.13 Docking.14), Jumpers_rev2 (JUMP5.2)